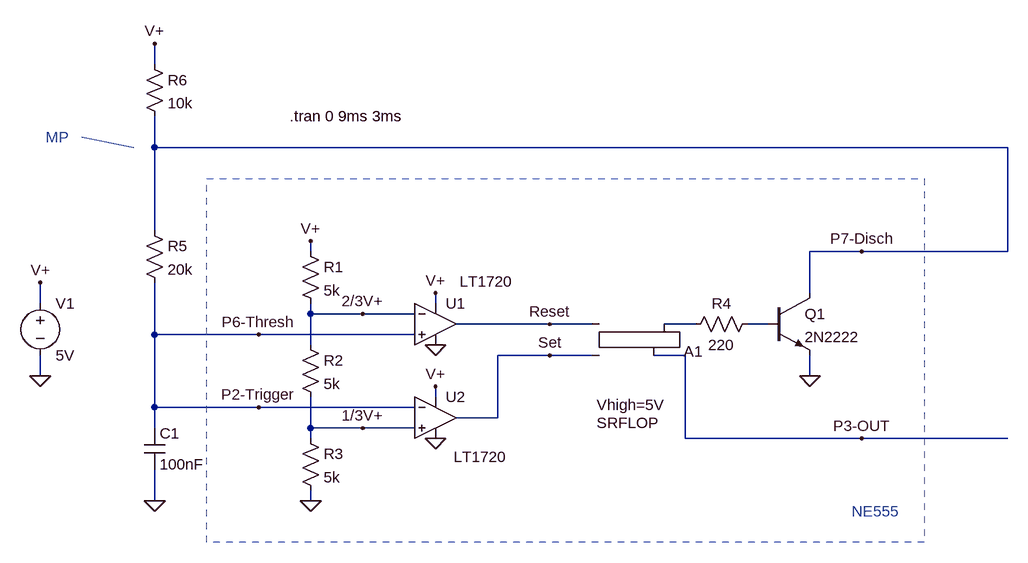
[diagram p0: schematic 555.asc]
555.asc, the LTspice schematic file:
Version 4
SHEET 1 1204 740
WIRE -112 -256 -112 -288
WIRE -112 -128 -112 -176
WIRE 1200 -128 -112 -128
WIRE -112 0 -112 -128
WIRE 128 32 128 16
WIRE 976 32 896 32
WIRE 1200 32 1200 -128
WIRE 1200 32 976 32
WIRE 896 96 896 32
WIRE -288 112 -288 80
WIRE 320 112 320 96
WIRE 128 128 128 112
WIRE 208 128 128 128
WIRE 288 128 208 128
WIRE 496 144 352 144
WIRE 560 144 496 144
WIRE 720 144 672 144
WIRE 832 144 800 144
WIRE -112 160 -112 80
WIRE 48 160 -112 160
WIRE 288 160 48 160
WIRE 128 176 128 128
WIRE 496 192 416 192
WIRE 560 192 496 192
WIRE 704 192 656 192
WIRE -288 224 -288 192
WIRE 896 224 896 192
WIRE 320 256 320 240
WIRE -112 272 -112 160
WIRE 48 272 -112 272
WIRE 288 272 48 272
WIRE 416 288 416 192
WIRE 416 288 352 288
WIRE -112 304 -112 272
WIRE 128 304 128 256
WIRE 208 304 128 304
WIRE 288 304 208 304
WIRE 128 320 128 304
WIRE 704 320 704 192
WIRE 976 320 704 320
WIRE 1200 320 976 320
WIRE -112 416 -112 368
WIRE 128 416 128 400
FLAG -288 80 V+
FLAG -288 224 0
FLAG 320 96 V+
FLAG 320 240 V+
FLAG 320 320 0
FLAG 320 176 0
FLAG 128 416 0
FLAG 128 16 V+
FLAG 896 224 0
FLAG 976 320 P3-OUT
FLAG 976 32 P7-Disch
FLAG 48 160 P6-Thresh
FLAG 48 272 P2-Trigger
FLAG -112 416 0
FLAG -112 -288 V+
FLAG 496 144 Reset
FLAG 496 192 Set
FLAG 208 304 1/3V+
FLAG 208 128 2/3V+
SYMBOL res 112 16 R0
SYMATTR InstName R1
SYMATTR Value 5k
SYMBOL res 112 160 R0
SYMATTR InstName R2
SYMATTR Value 5k
SYMBOL res 112 304 R0
SYMATTR InstName R3
SYMATTR Value 5k
SYMBOL Comparators\\LT1720 320 80 R0
WINDOW 3 37 -2 Left 0
SYMATTR InstName U1
SYMBOL Comparators\\LT1720 320 224 R0
WINDOW 3 28 124 Left 0
SYMATTR InstName U2
SYMBOL voltage -288 96 R0
WINDOW 123 0 0 Left 0
WINDOW 39 0 0 Left 0
SYMATTR InstName V1
SYMATTR Value 5V
SYMBOL Digital\\srflop 608 240 M180
WINDOW 38 -40 -56 Left 0
WINDOW 3 -40 -28 Left 0
SYMATTR Value Vhigh=5V
SYMATTR InstName A1
SYMBOL npn 832 96 R0
SYMATTR InstName Q1
SYMATTR Value 2N2222
SYMBOL res 816 128 R90
WINDOW 0 0 56 VBottom 0
WINDOW 3 32 56 VTop 0
SYMATTR InstName R4
SYMATTR Value 220
SYMBOL cap -128 304 R0
SYMATTR InstName C1
SYMATTR Value 100nF
SYMBOL res -128 -16 R0
SYMATTR InstName R5
SYMATTR Value 20k
SYMBOL res -128 -272 R0
SYMATTR InstName R6
SYMATTR Value 10k
TEXT 96 -176 Left 0 !.tran 0 9ms 3ms
TEXT 960 432 Left 0 ;NE555
TEXT -280 -144 Left 0 ;MP
LINE Normal -144 -128 -224 -144
RECTANGLE Normal 1072 480 -32 -80 2

The netlist it stands for:
* 555.asc
R1 V+ 2/3V+ 5k
R2 2/3V+ 1/3V+ 5k
R3 1/3V+ 0 5k
XU1 P2-Trigger 2/3V+ V+ 0 Reset LT1720  ; pins In+ In- V+ V- OUT
XU2 1/3V+ P2-Trigger V+ 0 Set LT1720  ; pins In+ In- V+ V- OUT
V1 V+ 0 5V
A1 Set Reset 0 0 0 N001 P3-OUT 0 SRFLOP Vhigh=5V
Q1 P7-Disch N002 0 0 2N2222
R4 N002 N001 220
C1 P2-Trigger 0 100nF
R5 P7-Disch P2-Trigger 20k
R6 V+ P7-Disch 10k
.model NPN NPN
.model PNP PNP
.lib standard.bjt
.tran 0 9ms 3ms
* NE555
* MP
.lib LT1720.sub
.backanno
.end